# Altium project HUD_V300.PrjPcb
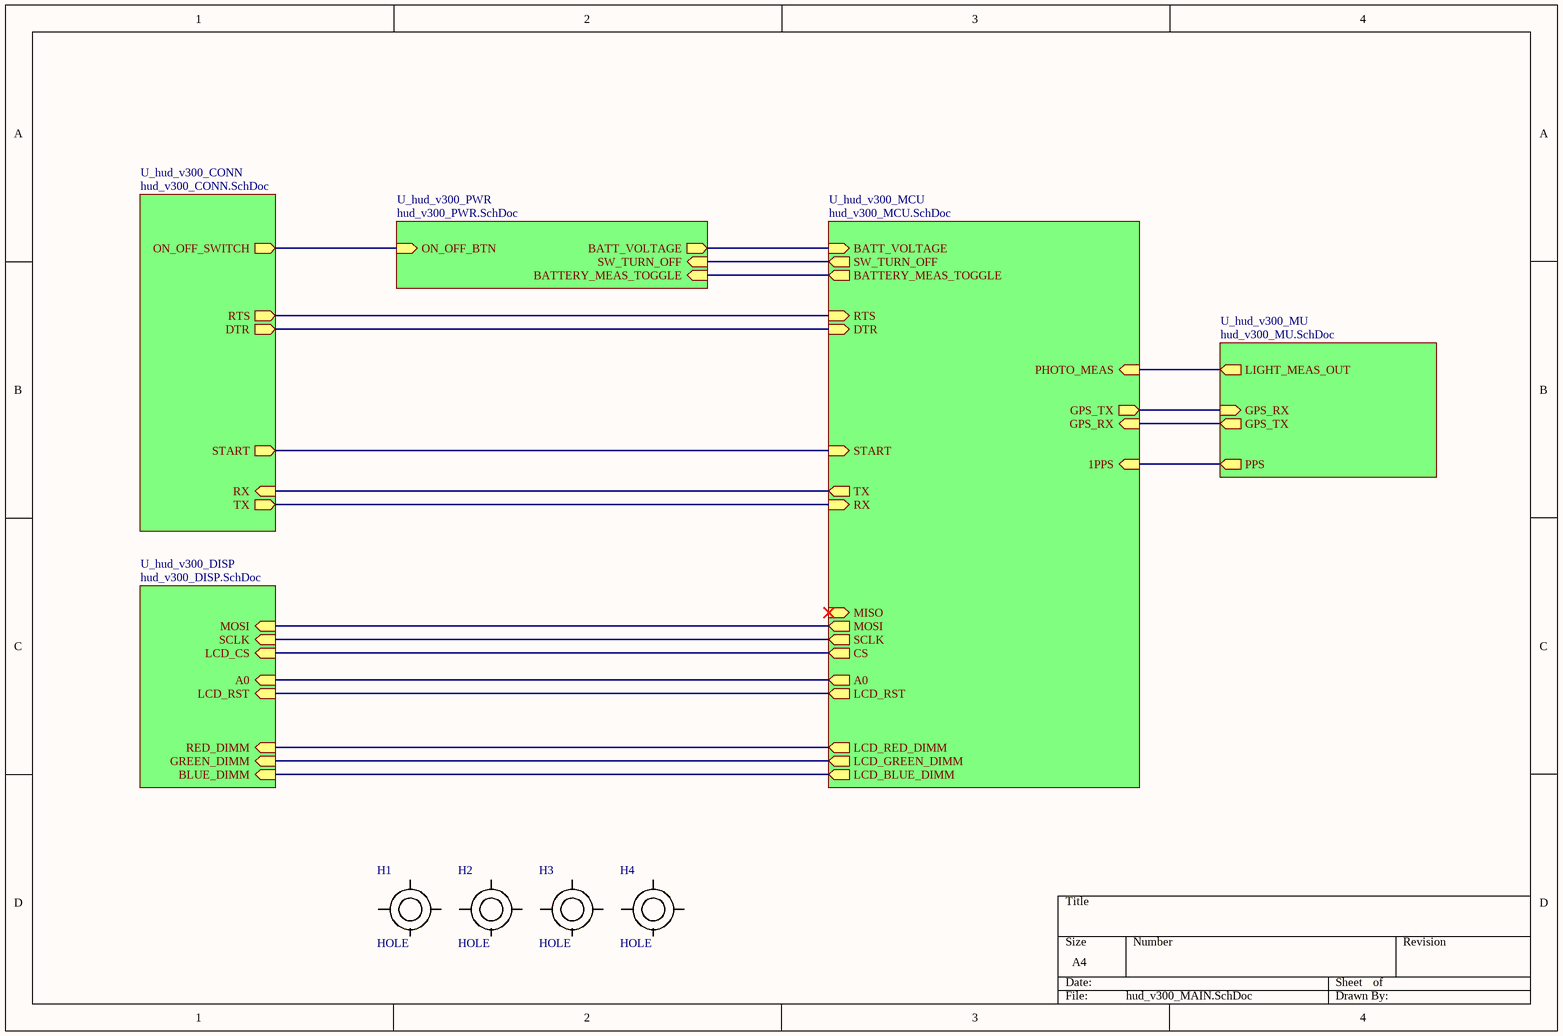
[diagram p0: hud_v300_MAIN.SchDoc]
6 sheets, 82 parts. Net scope: hierarchical (ports join the sheet entries above them; power ports are global).
Board file: hud_v300.PcbDoc
Sheets:
  hud_v300_MAIN.SchDoc
    U_hud_v300_CONN = hud_v300_CONN.SchDoc
    U_hud_v300_DISP = hud_v300_DISP.SchDoc
    U_hud_v300_MCU = hud_v300_MCU.SchDoc
    U_hud_v300_MU = hud_v300_MU.SchDoc
    U_hud_v300_PWR = hud_v300_PWR.SchDoc

## Sheet hud_v300_MAIN.SchDoc
size A4; SheetNumber: 1; SheetTotal: 6

### Parts
H1  HOLE  [HOLE_140_160MIL]
H2  HOLE  [HOLE_140_160MIL]
H3  HOLE  [HOLE_140_160MIL]
H4  HOLE  [HOLE_140_160MIL]

### Sub-sheets
U_hud_v300_CONN = hud_v300_CONN.SchDoc: RTS (out), DTR (out), TX (out), RX (in), ON_OFF_SWITCH (out), START (out)
U_hud_v300_DISP = hud_v300_DISP.SchDoc: MOSI (in), SCLK (in), RED_DIMM (in), GREEN_DIMM (in), BLUE_DIMM (in), A0 (in), LCD_CS (in), LCD_RST (in)
U_hud_v300_MCU = hud_v300_MCU.SchDoc: DTR (in), RTS (in), RX (in), TX (out), LCD_RED_DIMM (out), LCD_GREEN_DIMM (out), LCD_BLUE_DIMM (out), PHOTO_MEAS (in), SW_TURN_OFF (out), BATT_VOLTAGE (in), BATTERY_MEAS_TOGGLE (out), GPS_RX (in), GPS_TX (out), MOSI (out), MISO (in), SCLK (out), CS (out), LCD_RST (out), A0 (out), START (in), 1PPS (in)
U_hud_v300_MU = hud_v300_MU.SchDoc: PPS (out), LIGHT_MEAS_OUT (out), GPS_TX (out), GPS_RX (in)
U_hud_v300_PWR = hud_v300_PWR.SchDoc: BATTERY_MEAS_TOGGLE (in), BATT_VOLTAGE (out), ON_OFF_BTN (in), SW_TURN_OFF (in)

### Nets
1PPS: sheet U_hud_v300_MCU/1PPS, sheet U_hud_v300_MU/PPS
GPS_RX: sheet U_hud_v300_MCU/GPS_TX, sheet U_hud_v300_MU/GPS_RX
GPS_TX: sheet U_hud_v300_MCU/GPS_RX, sheet U_hud_v300_MU/GPS_TX
ON_OFF: sheet U_hud_v300_CONN/ON_OFF_SWITCH, sheet U_hud_v300_PWR/ON_OFF_BTN
START: sheet U_hud_v300_CONN/START, sheet U_hud_v300_MCU/START
NetP2_2: sheet U_hud_v300_MCU/PHOTO_MEAS, sheet U_hud_v300_MU/LIGHT_MEAS_OUT
NetR7_1: sheet U_hud_v300_MCU/BATT_VOLTAGE, sheet U_hud_v300_PWR/BATT_VOLTAGE
NetR11_2: sheet U_hud_v300_MCU/SW_TURN_OFF, sheet U_hud_v300_PWR/SW_TURN_OFF
NetR14_2: sheet U_hud_v300_CONN/TX, sheet U_hud_v300_MCU/RX
NetR16_2: sheet U_hud_v300_CONN/RX, sheet U_hud_v300_MCU/TX
NetR18_2: sheet U_hud_v300_CONN/DTR, sheet U_hud_v300_MCU/DTR
NetR19_2: sheet U_hud_v300_CONN/RTS, sheet U_hud_v300_MCU/RTS
NetR25_1: sheet U_hud_v300_DISP/LCD_RST, sheet U_hud_v300_MCU/LCD_RST
NetR26_1: sheet U_hud_v300_DISP/LCD_CS, sheet U_hud_v300_MCU/CS
NetR27_1: sheet U_hud_v300_DISP/A0, sheet U_hud_v300_MCU/A0
NetR28_1: sheet U_hud_v300_DISP/SCLK, sheet U_hud_v300_MCU/SCLK
NetR29_1: sheet U_hud_v300_DISP/MOSI, sheet U_hud_v300_MCU/MOSI
NetT2_1: sheet U_hud_v300_MCU/BATTERY_MEAS_TOGGLE, sheet U_hud_v300_PWR/BATTERY_MEAS_TOGGLE
NetT5_1: sheet U_hud_v300_DISP/BLUE_DIMM, sheet U_hud_v300_MCU/LCD_BLUE_DIMM
NetT6_1: sheet U_hud_v300_DISP/GREEN_DIMM, sheet U_hud_v300_MCU/LCD_GREEN_DIMM
NetT7_1: sheet U_hud_v300_DISP/RED_DIMM, sheet U_hud_v300_MCU/LCD_RED_DIMM

## Sheet hud_v300_CONN.SchDoc
size A4; SheetNumber: 4; SheetTotal: 6
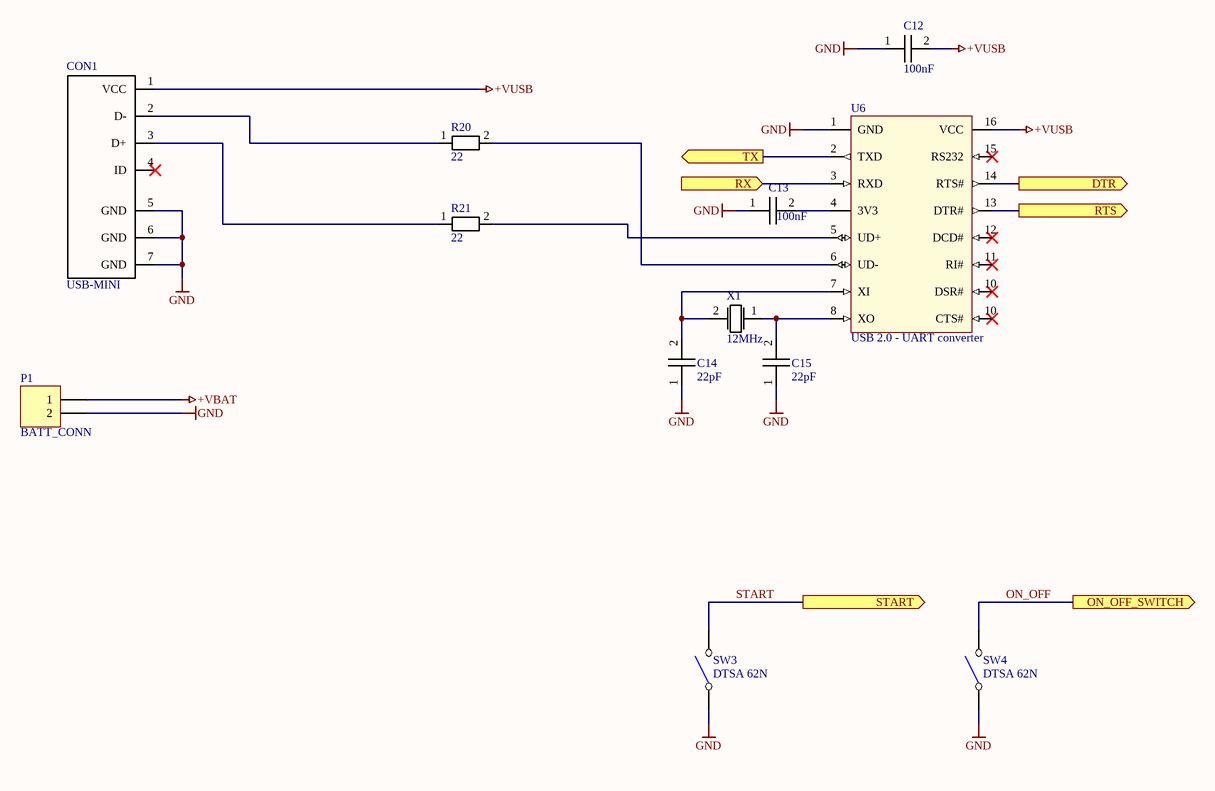
[diagram p1: hud_v300_CONN.SchDoc]

### Parts
C12  100nF  [0805_C]
C13  100nF  [0805_C]
C14  22pF  [0805_C]
C15  22pF  [0805_C]
CON1  USB-MINI  [USB-MINI]
P1  BATT_CONN  [HDR1X2]
R20  22  [0805]
R21  22  [0805]
SW3  DTSA 62N  [SW_DTSA-62N]
SW4  DTSA 62N  [SW_DTSA-62N]
U6  USB 2.0 - UART converter  [SOP127P660X265-16N]
X1  12MHz  [XTAL_SMALL]

### Ports
DTR (out, see hud_v300_MAIN[1B], hud_v300_MCU[2D]), ON_OFF_SWITCH (out, see hud_v300_MAIN[1A]), RTS (out, see hud_v300_MAIN[1B], hud_v300_MCU[2D]), RX (in, see hud_v300_MAIN[1B]), START (out, see hud_v300_MAIN[1B], hud_v300_MCU[4B]), TX (out, see hud_v300_MAIN[1B])

### Nets
+VBAT: P1.1
+VUSB: C12.2 CON1.1(VCC) U6.16(VCC)
GND: C12.1 C13.1 C14.1 C15.1 CON1.5(GND) CON1.6(GND) CON1.7(GND) P1.2 SW3.1 SW4.1 U6.1(GND)
ON_OFF: SW4.2 ; port ON_OFF_SWITCH
START: SW3.2 ; port START
NetC13_2: C13.2 U6.4(3V3)
NetC14_2: C14.2 U6.7(XI) X1.2
NetC15_2: C15.2 U6.8(XO) X1.1
NetCON1_2: CON1.2(D-) R20.1
NetCON1_3: CON1.3(D+) R21.1
NetR14_2: U6.2(TXD) ; port TX
NetR16_2: U6.3(RXD) ; port RX
NetR18_2: U6.14(RTS#) ; port DTR
NetR19_2: U6.13(DTR#) ; port RTS
NetR20_2: R20.2 U6.6(UD-)
NetR21_2: R21.2 U6.5(UD+)

Not connected (* = marked no-connect by the designer): CON1 4(ID)*; U6 10(DSR#)* 11(RI#)* 12(DCD#)* 15(RS232)*

### Library data of the parts
C12-C15 = CAPACITOR
P1 = Header 2: Header, 2-Pin; LatestRevisionDate: 17-Jul-2002; LatestRevisionNote: Re-released for DXP Platform.; Publisher: Altium Limited
R20 R21 = RESISTOR: Parameter 1: 10k
SW3 SW4 = SW_DTSA 62N
U6 = CH340G: Full-speed USB interface, compatible with USB 2.0 interface / Operates with a minimum amount of external components: a crystal and a minimum of four capacitors
X1 = XTAL

## Sheet hud_v300_DISP.SchDoc
size A4; SheetNumber: 6; SheetTotal: 6
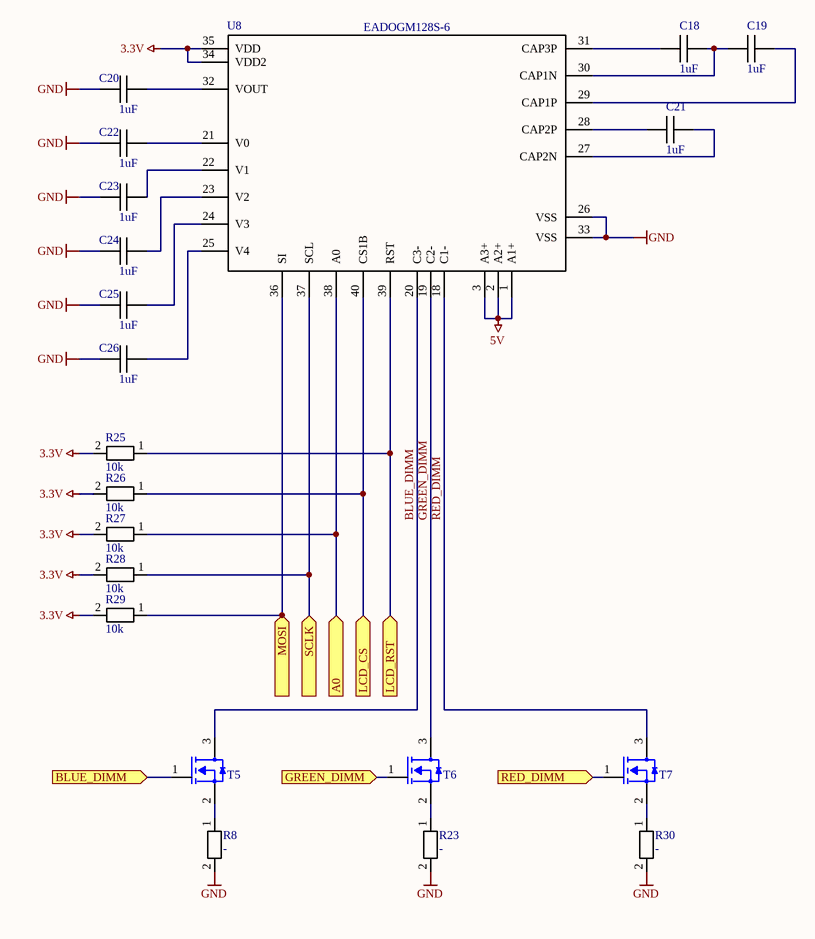
[diagram p2: hud_v300_DISP.SchDoc]

### Parts
C18  1uF  [0805_C]
C19  1uF  [0805_C]
C20  1uF  [0805_C]
C21  1uF  [0805_C]
C22  1uF  [0805_C]
C23  1uF  [0805_C]
C24  1uF  [0805_C]
C25  1uF  [0805_C]
C26  1uF  [0805_C]
R8  -  [0805]
R23  -  [0805]
R25  10k  [0805]
R26  10k  [0805]
R27  10k  [0805]
R28  10k  [0805]
R29  10k  [0805]
R30  -  [0805]
T5  MMBF170  [SOT23]  (value not drawn)
T6  MMBF170  [SOT23]  (value not drawn)
T7  MMBF170  [SOT23]  (value not drawn)
U8  EADOGM128S-6  [EADOGM128-S]

### Ports
A0 (in, see hud_v300_MAIN[1C], hud_v300_MCU[4C]), BLUE_DIMM (in, see hud_v300_MAIN[1D]), GREEN_DIMM (in, see hud_v300_MAIN[1C]), LCD_CS (in, see hud_v300_MAIN[1C]), LCD_RST (in, see hud_v300_MAIN[1C], hud_v300_MCU[4B]), MOSI (in, see hud_v300_MAIN[1C], hud_v300_MCU[3B]), RED_DIMM (in, see hud_v300_MAIN[1C]), SCLK (in, see hud_v300_MAIN[1C], hud_v300_MCU[3B])

### Nets
3.3V: R25.2 R26.2 R27.2 R28.2 R29.2 U8.34(VDD2) U8.35(VDD)
5V: U8.1(A1+) U8.2(A2+) U8.3(A3+)
GND: C20.1 C22.1 C23.1 C24.1 C25.1 C26.1 R8.2 R23.2 R30.2 U8.26(VSS) U8.33(VSS)
BLUE_DIMM: T5.3(Drain) U8.20(C3-)
GREEN_DIMM: T6.3(Drain) U8.19(C2-)
RED_DIMM: T7.3(Drain) U8.18(C1-)
NetC18_1: C18.1 C19.2 U8.30(CAP1N)
NetC18_2: C18.2 U8.31(CAP3P)
NetC19_1: C19.1 U8.29(CAP1P)
NetC20_2: C20.2 U8.32(VOUT)
NetC21_1: C21.1 U8.27(CAP2N)
NetC21_2: C21.2 U8.28(CAP2P)
NetC22_2: C22.2 U8.21(V0)
NetC23_2: C23.2 U8.22(V1)
NetC24_2: C24.2 U8.23(V2)
NetC25_2: C25.2 U8.24(V3)
NetC26_2: C26.2 U8.25(V4)
NetR8_1: R8.1 T5.2(Source)
NetR23_1: R23.1 T6.2(Source)
NetR25_1: R25.1 U8.39(RST) ; port LCD_RST
NetR26_1: R26.1 U8.40(CS1B) ; port LCD_CS
NetR27_1: R27.1 U8.38(A0) ; port A0
NetR28_1: R28.1 U8.37(SCL) ; port SCLK
NetR29_1: R29.1 U8.36(SI) ; port MOSI
NetR30_1: R30.1 T7.2(Source)
NetT5_1: T5.1(Gate) ; port BLUE_DIMM
NetT6_1: T6.1(Gate) ; port GREEN_DIMM
NetT7_1: T7.1(Gate) ; port RED_DIMM

### Library data of the parts
C18-C26 = CAPACITOR
R8 R23 R30 = RESISTOR: Parameter 1: 10k
R25-R29 = RESISTOR: Parameter 1: 10k
T5-T7 = MMBF170: N MOSFET
U8 = EADOGM128S-6: 128x64 LCD Module with custom RGB Backlight

## Sheet hud_v300_MCU.SchDoc
size A4; SheetNumber: 3; SheetTotal: 6
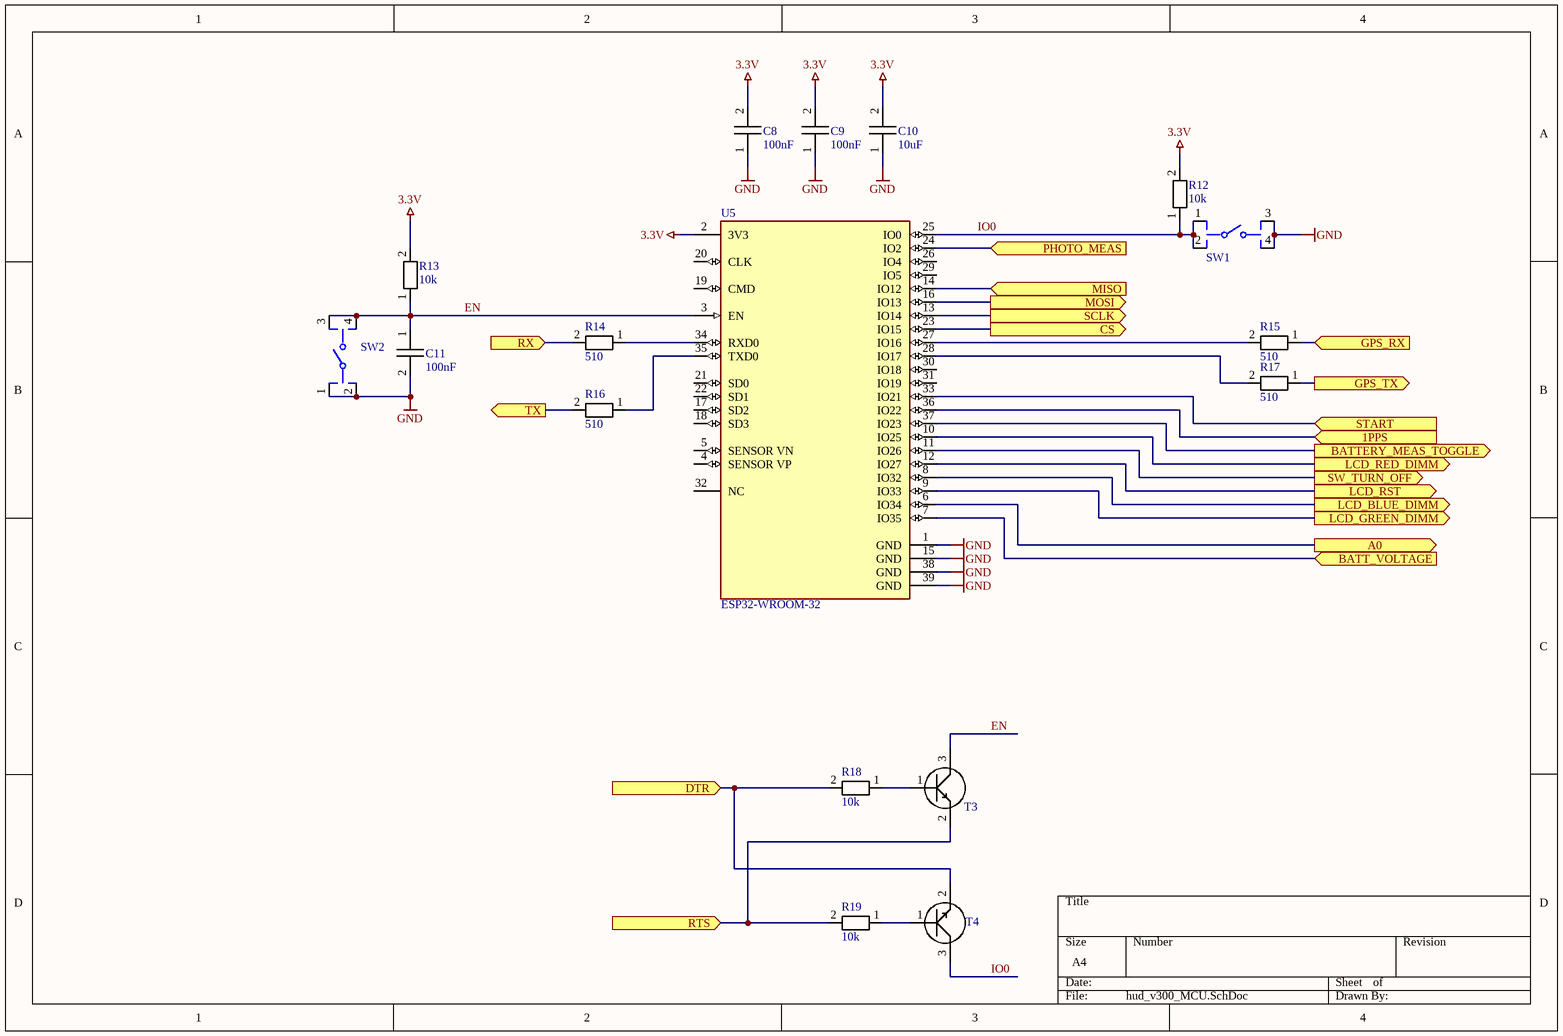
[diagram p3: hud_v300_MCU.SchDoc]

### Parts
C8  100nF  [0805_C]
C9  100nF  [0805_C]
C10  10uF  [1210_C]
C11  100nF  [0805_C]
R12  10k  [0805]
R13  10k  [0805]
R14  510  [0805]
R15  510  [0805]
R16  510  [0805]
R17  510  [0805]
R18  10k  [0805]
R19  10k  [0805]
SW1  Switch_C&K_KSC241JLFS_eec  [C&K_KSC241JLFS]  (value not drawn)
SW2  Switch_C&K_KSC241JLFS_eec  [C&K_KSC241JLFS]  (value not drawn)
T3  BC848*  [SOT23]  (value not drawn)
T4  BC848*  [SOT23]  (value not drawn)
U5  ESP32-WROOM-32  [FP-ESP32-WROOM-32-MFG]

### Ports
1PPS (in, see hud_v300_MAIN[3B]), A0 (out, see hud_v300_MAIN[3C], hud_v300_DISP[2D]), BATT_VOLTAGE (in, see hud_v300_MAIN[3A], hud_v300_PWR[3C]), BATTERY_MEAS_TOGGLE (out, see hud_v300_MAIN[3B], hud_v300_PWR[3C]), CS (out, see hud_v300_MAIN[3C]), DTR (in, see hud_v300_MAIN[3B], hud_v300_CONN[4B]), GPS_RX (in, see hud_v300_MAIN[3B]), GPS_TX (out, see hud_v300_MAIN[3B]), LCD_BLUE_DIMM (out, see hud_v300_MAIN[3D]), LCD_GREEN_DIMM (out, see hud_v300_MAIN[3C]), LCD_RED_DIMM (out, see hud_v300_MAIN[3C]), LCD_RST (out, see hud_v300_MAIN[3C], hud_v300_DISP[2D]), MISO (in, see hud_v300_MAIN[3C]), MOSI (out, see hud_v300_MAIN[3C], hud_v300_DISP[2D]), PHOTO_MEAS (in, see hud_v300_MAIN[3B]), RTS (in, see hud_v300_MAIN[3B], hud_v300_CONN[4B]), RX (in, see hud_v300_MAIN[3B]), SCLK (out, see hud_v300_MAIN[3C], hud_v300_DISP[2D]), START (in, see hud_v300_MAIN[3B], hud_v300_CONN[3C]), SW_TURN_OFF (out, see hud_v300_MAIN[3B], hud_v300_PWR[2D]), TX (out, see hud_v300_MAIN[3B])

### Nets
3.3V: C8.2 C9.2 C10.2 R12.2 R13.2 U5.2(3V3)
GND: C8.1 C9.1 C10.1 C11.2 SW1.3 SW1.4 SW2.1 SW2.2 U5.1(GND) U5.15(GND) U5.38(GND) U5.39(GND)
1PPS: U5.36(IO22) ; port 1PPS
EN: C11.1 R13.1 SW2.3 SW2.4 T3.3 U5.3(EN)
GPS_RX: R17.1 ; port GPS_TX
GPS_TX: R15.1 ; port GPS_RX
IO0: R12.1 SW1.1 SW1.2 T4.3 U5.25(IO0)
START: U5.33(IO21) ; port START
NetP2_2: U5.24(IO2) ; port PHOTO_MEAS
NetR7_1: U5.7(IO35) ; port BATT_VOLTAGE
NetR11_2: U5.11(IO26) ; port SW_TURN_OFF
NetR14_1: R14.1 U5.34(RXD0)
NetR14_2: R14.2 ; port RX
NetR15_2: R15.2 U5.27(IO16)
NetR16_1: R16.1 U5.35(TXD0)
NetR16_2: R16.2 ; port TX
NetR17_2: R17.2 U5.28(IO17)
NetR18_1: R18.1 T3.1
NetR18_2: R18.2 T4.2 ; port DTR
NetR19_1: R19.1 T4.1
NetR19_2: R19.2 T3.2 ; port RTS
NetR25_1: U5.12(IO27) ; port LCD_RST
NetR26_1: U5.23(IO15) ; port CS
NetR27_1: U5.6(IO34) ; port A0
NetR28_1: U5.13(IO14) ; port SCLK
NetR29_1: U5.16(IO13) ; port MOSI
NetT2_1: U5.37(IO23) ; port BATTERY_MEAS_TOGGLE
NetT5_1: U5.8(IO32) ; port LCD_BLUE_DIMM
NetT6_1: U5.9(IO33) ; port LCD_GREEN_DIMM
NetT7_1: U5.10(IO25) ; port LCD_RED_DIMM
NetU5_14: U5.14(IO12) ; port MISO

Not connected (* = marked no-connect by the designer): U5 4(SENSOR_VP) 5(SENSOR_VN) 17(SD2) 18(SD3) 19(CMD) 20(CLK) 21(SD0) 22(SD1) 26(IO4) 29(IO5) 30(IO18) 31(IO19) 32(NC)

### Library data of the parts
C8-C11 = CAPACITOR
R12 R13 R18 R19 = RESISTOR: Parameter 1: 10k
R14-R17 = RESISTOR: Parameter 1: 10k
SW1 SW2 = Switch_C&K_KSC241JLFS_eec: SWITCH TACTILE SPST-NO 0.05A 32V; Manufacturer: C&K; Part Number: KSC241JLFS; helpURL: https://upverter.com/upn/revision/9eb490e79e988993/; ComponentLink2Description: Datasheet; Temperature: -40°C to +85°C; Package: SMT_SW_6MM2_6MM2; Supplier 2: Mouser; Supplier 1: Digi-Key; ComponentLink1URL: https://upverter.com/upn/revision/9eb490e79e988993/; Supplier Part Number 2: 611-KSC241J-LFS; Supplier Part Number 1: 401-1762-1-ND; ComponentLink1Description: Upverter; ComponentLink2URL: http://www.ckswitches.com/media/1459/ksc.pdf; RoHS: TRUE; Mouser Part Number: 611-KSC241J-LFS; Digikey Description: SWITCH TACTILE SPST-NO 0.05A 32V; Digikey Part Number: 401-1762-1-ND; Lead Free: yes; Temperature Range Low: -40°C; Temperature Range High: +85°C
T3 T4 = TRANSISTOR_NPN
U5 = ESP32-WROOM-32: IC RF TXRX+MCU BLUETOOTH 48VFQFN

## Sheet hud_v300_MU.SchDoc
size A4; SheetNumber: 5; SheetTotal: 6
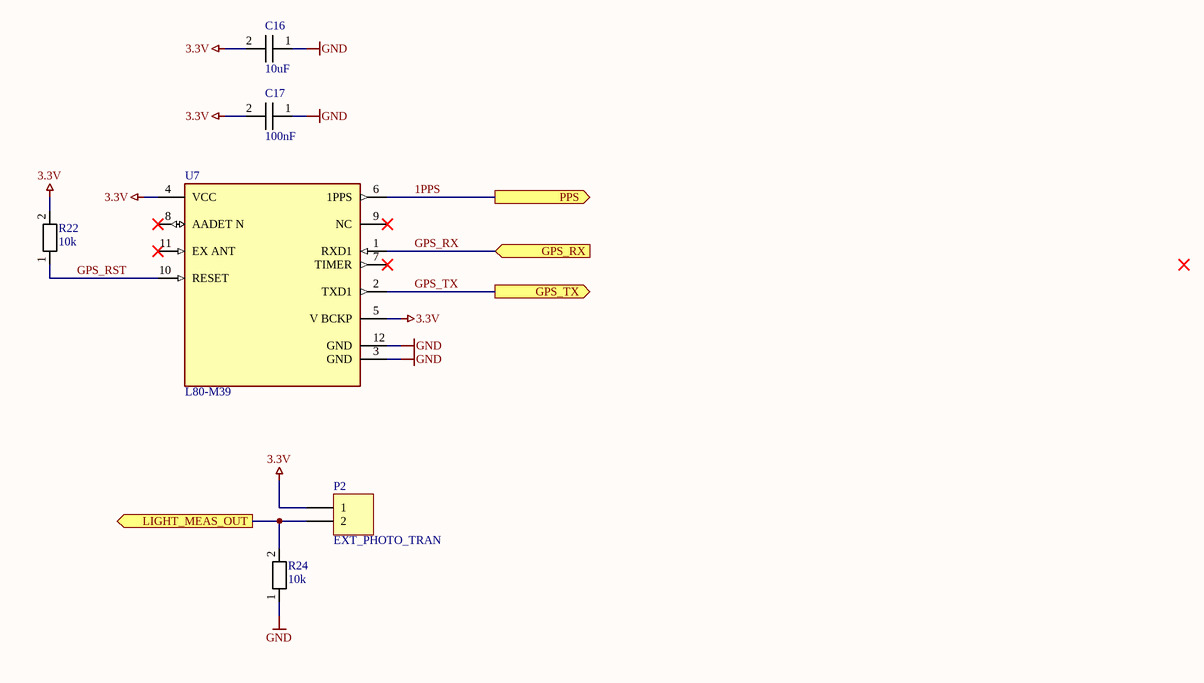
[diagram p4: hud_v300_MU.SchDoc]

### Parts
C16  10uF  [1210_C]
C17  100nF  [0805_C]
P2  EXT_PHOTO_TRAN  [HDR1X2]
R22  10k  [0805]
R24  10k  [0805]
U7  L80-M39  [L80-M39]

### Ports
GPS_RX (in, see hud_v300_MAIN[4B]), GPS_TX (out, see hud_v300_MAIN[4B]), LIGHT_MEAS_OUT (out, see hud_v300_MAIN[4B]), PPS (out, see hud_v300_MAIN[4B])

### Nets
3.3V: C16.2 C17.2 P2.1 R22.2 U7.4(VCC) U7.5(V_BCKP)
GND: C16.1 C17.1 R24.1 U7.3(GND) U7.12(GND)
1PPS: U7.6(1PPS) ; port PPS
GPS_RST: R22.1 U7.10(RESET)
GPS_RX: U7.1(RXD1) ; port GPS_RX
GPS_TX: U7.2(TXD1) ; port GPS_TX
NetP2_2: P2.2 R24.2 ; port LIGHT_MEAS_OUT

Not connected (* = marked no-connect by the designer): U7 7(TIMER)* 8(AADET_N)* 9(NC)* 11(EX_ANT)*

### Library data of the parts
C16 C17 = CAPACITOR
P2 = Header 2: Header, 2-Pin; LatestRevisionDate: 17-Jul-2002; LatestRevisionNote: Re-released for DXP Platform.; Publisher: Altium Limited
R22 R24 = RESISTOR: Parameter 1: 10k
U7 = L80-M39: QUECTEL GPS MODULE

## Sheet hud_v300_PWR.SchDoc
size A4; SheetNumber: 2; SheetTotal: 6
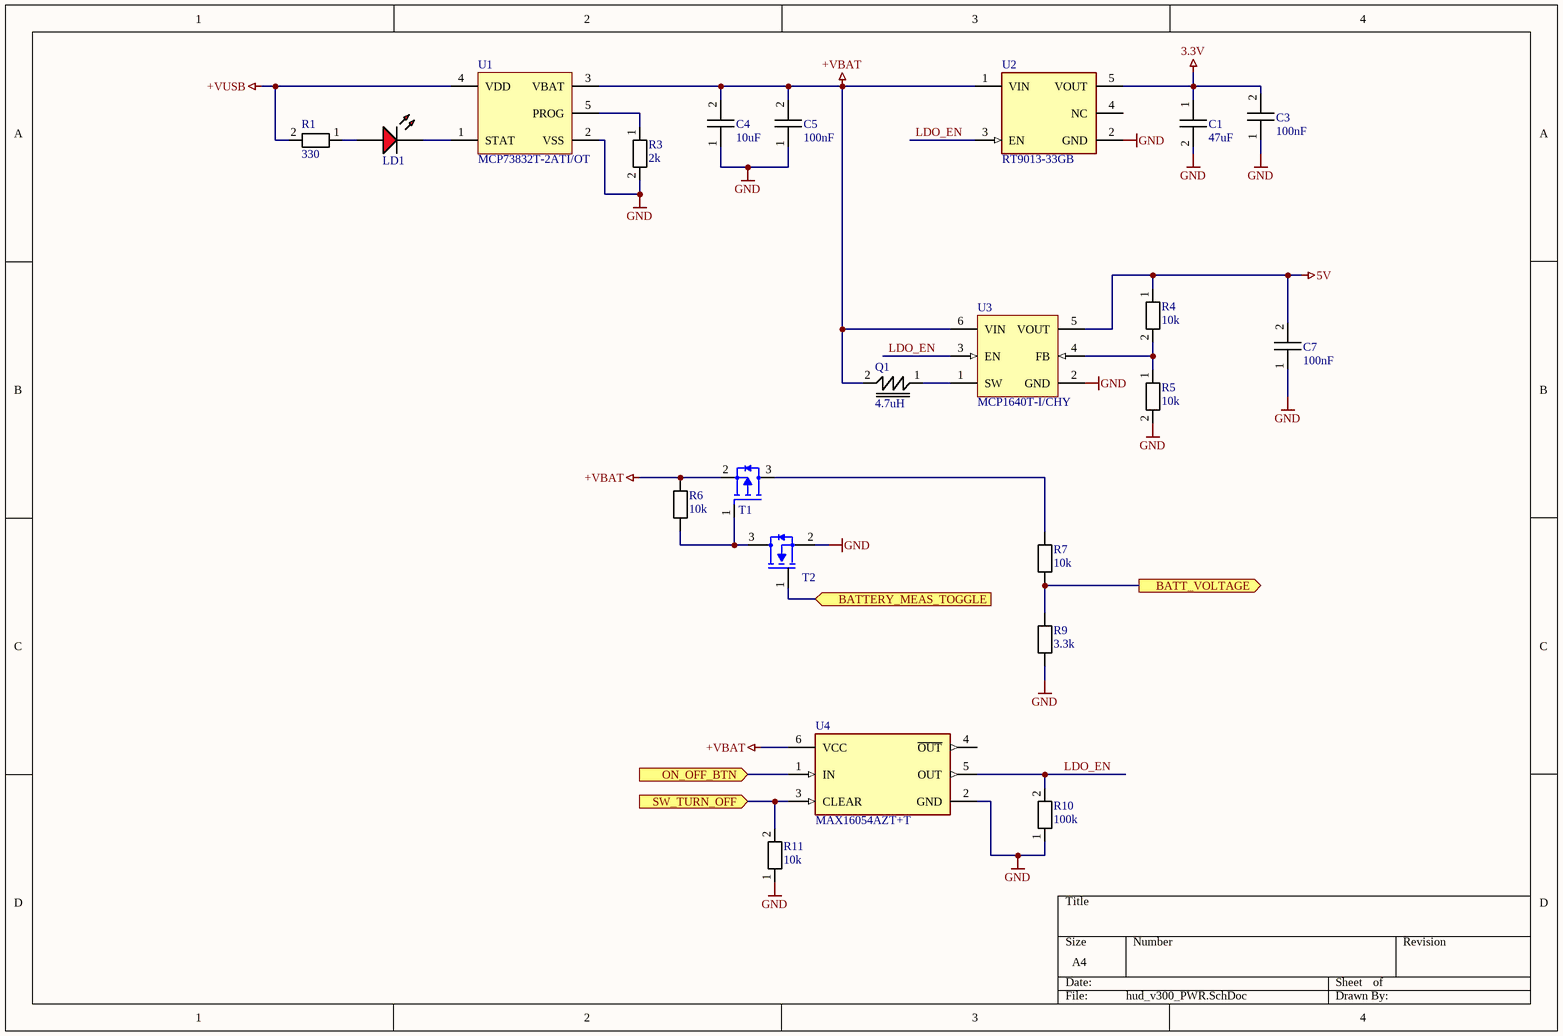
[diagram p5: hud_v300_PWR.SchDoc]

### Parts
C1  47uF  [0805_C]
C3  100nF  [0805_C]
C4  10uF  [1210_C]
C5  100nF  [0805_C]
C7  100nF  [0805_C]
LD1  LED_RED  [LED_SMD_90DEG_RED]  (value not drawn)
Q1  4.7uH  [1210]
R1  330  [0805]
R3  2k  [0805]
R4  10k  [0805]
R5  10k  [0805]
R6  10k  [0805]
R7  10k  [0805]
R9  3.3k  [0805]
R10  100k  [0805]
R11  10k  [0805]
T1  BSS84  [SOT23]  (value not drawn)
T2  MMBF170  [SOT23]  (value not drawn)
U1  MCP73832T-2ATI/OT  [SOT23-5]
U2  RT9013-33GB  [SOT23-5]
U3  MCP1640T-I/CHY  [SOT23-6]
U4  MAX16054AZT+T  [FP-Z6-1-IPC_A]

### Ports
BATT_VOLTAGE (out, see hud_v300_MAIN[2A], hud_v300_MCU[4C]), BATTERY_MEAS_TOGGLE (in, see hud_v300_MAIN[2B], hud_v300_MCU[4B]), ON_OFF_BTN (in, see hud_v300_MAIN[2A]), SW_TURN_OFF (in, see hud_v300_MAIN[2B], hud_v300_MCU[4B])

### Nets
3.3V: C1.1 C3.2 U2.5(VOUT)
5V: C7.2 R4.1 U3.5(VOUT)
+VBAT: C4.2 C5.2 Q1.2 R6.2 T1.2(S) U1.3(VBAT) U2.1(VIN) U3.6(VIN) U4.6(VCC)
+VUSB: R1.2 U1.4(VDD)
GND: C1.2 C3.1 C4.1 C5.1 C7.1 R3.2 R5.2 R9.1 R10.1 R11.1 T2.2(Source) U1.2(VSS) U2.2(GND) U3.2(GND) U4.2(GND)
LDO_EN: R10.2 U2.3(EN) U3.3(EN) U4.5(OUT)
ON_OFF: U4.1(IN) ; port ON_OFF_BTN
NetLD1_A: LD1.A R1.1
NetLD1_K: LD1.K U1.1(STAT)
NetQ1_1: Q1.1 U3.1(SW)
NetR3_1: R3.1 U1.5(PROG)
NetR4_2: R4.2 R5.1 U3.4(FB)
NetR6_1: R6.1 T1.1(G) T2.3(Drain)
NetR7_1: R7.1 R9.2 ; port BATT_VOLTAGE
NetR7_2: R7.2 T1.3(D)
NetR11_2: R11.2 U4.3(CLEAR) ; port SW_TURN_OFF
NetT2_1: T2.1(Gate) ; port BATTERY_MEAS_TOGGLE

Not connected (* = marked no-connect by the designer): U2 4(NC); U4 4(~{OUT})

### Library data of the parts
C1 C3-C5 C7 = CAPACITOR
LD1 = LED_RED: Type (0°): LTSTC170CKT; Type (90°): HSMS-C110
Q1 = COIL
R1 R3 R9 R10 = RESISTOR: Parameter 1: 10k
R4-R7 R11 = RESISTOR: Parameter 1: 10k
T1 = BSS84: P-Chanel MOSFET
T2 = MMBF170: N MOSFET
U1 = MCP73832T-2ATI/OT: Miniature Single-Cell, Fully Integrated Li-Ion, Li-Polymer Charge Management Controller, 4.2V, 5-Pin SOT-23, Industrial Temperature, Tape and Reel
U2 = RT9013-33GB: 500mA, Low Dropout, Low Noise Ultra-Fast Without / Bypass Capacitor CMOS LDO Regulator
U3 = MCP1640T-I/CHY: Start-up Synchronous Boost Regulator with True Output Disconnect or Input / Output Bypass Option, 350 mA, Input Voltage 0.65 to 5.5 V, Output Voltage 2.0 to 5.5 V, -40 to 85 degC, 6-pin SOT-23 (CHY6), Tape and Reel
U4 = CMP-0251-00627-2: IC INTFACE SPECIALIZED TSOT23-6; Undervoltage Threshold: 1.8V; Max Supply Voltage: 5.5V; Min Supply Voltage: 2.7V; Max Power Dissipation: 727W; Number of Voltages Monitored: 1; Watchdog Timer: No; Operating Supply Current: 7uA; Output Type: PUSH-PULL; RoHS Compliant: Yes; Series: -; Contact Plating: Tin; Length: 4mm; Height: 0.73mm; Radiation Hardening: No; Number of Pins: 6; Min Operating Temperature: -40°C; Width: 4mm; Mount: Surface Mount; Package Quantity: 1; Max Operating Temperature: 125°C; Packaging: Tape and Reel; Case/Package: SOT-23-6

## Nets that join several sheets
3.3V: hud_v300_DISP (7 pins), hud_v300_MCU (6 pins), hud_v300_MU (6 pins), hud_v300_PWR (C1.1 C3.2 U2.5)
5V: hud_v300_DISP (U8.1 U8.2 U8.3), hud_v300_PWR (C7.2 R4.1 U3.5)
+VBAT: hud_v300_CONN (P1.1), hud_v300_PWR (9 pins)
+VUSB: hud_v300_CONN (C12.2 CON1.1 U6.16), hud_v300_PWR (R1.2 U1.4)
GND: hud_v300_CONN (11 pins), hud_v300_DISP (11 pins), hud_v300_MCU (12 pins), hud_v300_MU (5 pins), hud_v300_PWR (15 pins)
1PPS: hud_v300_MCU (U5.36), hud_v300_MU (U7.6)
GPS_RX: hud_v300_MCU (R17.1), hud_v300_MU (U7.1)
GPS_TX: hud_v300_MCU (R15.1), hud_v300_MU (U7.2)
NetP2_2: hud_v300_MCU (U5.24), hud_v300_MU (P2.2 R24.2)
NetR7_1: hud_v300_MCU (U5.7), hud_v300_PWR (R7.1 R9.2)
NetR11_2: hud_v300_MCU (U5.11), hud_v300_PWR (R11.2 U4.3)
NetR14_2: hud_v300_CONN (U6.2), hud_v300_MCU (R14.2)
NetR16_2: hud_v300_CONN (U6.3), hud_v300_MCU (R16.2)
NetR18_2: hud_v300_CONN (U6.14), hud_v300_MCU (R18.2 T4.2)
NetR19_2: hud_v300_CONN (U6.13), hud_v300_MCU (R19.2 T3.2)
NetR25_1: hud_v300_DISP (R25.1 U8.39), hud_v300_MCU (U5.12)
NetR26_1: hud_v300_DISP (R26.1 U8.40), hud_v300_MCU (U5.23)
NetR27_1: hud_v300_DISP (R27.1 U8.38), hud_v300_MCU (U5.6)
NetR28_1: hud_v300_DISP (R28.1 U8.37), hud_v300_MCU (U5.13)
NetR29_1: hud_v300_DISP (R29.1 U8.36), hud_v300_MCU (U5.16)
NetT2_1: hud_v300_MCU (U5.37), hud_v300_PWR (T2.1)
NetT5_1: hud_v300_DISP (T5.1), hud_v300_MCU (U5.8)
NetT6_1: hud_v300_DISP (T6.1), hud_v300_MCU (U5.9)
NetT7_1: hud_v300_DISP (T7.1), hud_v300_MCU (U5.10)
ON_OFF: hud_v300_CONN (SW4.2), hud_v300_PWR (U4.1)
START: hud_v300_CONN (SW3.2), hud_v300_MCU (U5.33)